# EAGLE design LED Driver (EAGLE 8.6.3)
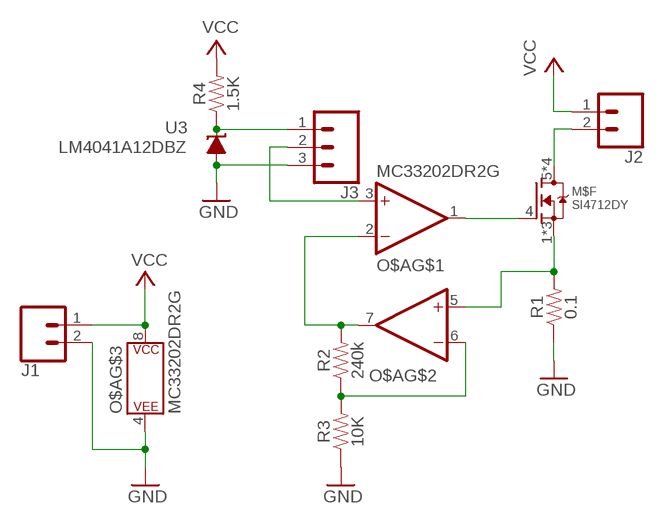
[diagram p0: schematic, sheet 1]

## Parts
J1  CONN_02PTH4  [1X02_XTRA_BIG]
J2  CONN_02PTH4  [1X02_XTRA_BIG]
J3  CONN_03  [1X03]
M$F  SI4712DY  [SO8]
O$A  MC33202DR2G  [SOIC8]
R1  0.1  0.1OHM-1210-1/2W-1%  [1210]
R2  240k  1.20KOHM-0603-1/10W-1%  [0603]
R3  10K  1.20KOHM-0603-1/10W-1%  [0603]
R4  1.5K  1.20KOHM-0603-1/10W-1%  [0603]
U3  LM4041A12DBZ  [DBZ_R-PDSO-G3]

## Nets
GND [POWER]: J1.2 J3.3 O$A.4(P$V-) R1.1 R3.1 U3.2(A)
N$1: J3.1 R4.1 U3.1(C)
N$2: J3.2 O$A.3(+IN)
N$3: M$F.4(G) O$A.1(OUT)
N$4 [POWER]: J2.2 M$F.5(D) M$F.6(D) M$F.7(D) M$F.8(D)
N$5 [POWER]: M$F.1(S) M$F.2(S) M$F.3(S) O$A.5(+IN) R1.2
N$6: O$A.2(-IN) O$A.7(OUT) R2.2
N$7: O$A.6(-IN) R2.1 R3.2
VCC [POWER]: J1.1 J2.1 O$A.8(P$V+) R4.2

## Library data of the parts
J1 J2 = SparkFun-Connectors:CONN_02: Multi connection point. Often used as Generic Header-pin footprint for 0.1 inch spaced/style header connections On any of the 0.1 inch spaced packages, you can populate with these: Break Away Headers - Straight <https://www.sparkfun.com/products/116> (PRT-00116) Break Away Male Headers - Right Angle <https://www.sparkfun.com/products/553> (PRT-00553) Female Headers <https://www.sparkfun.com/products/115> (PRT-00115) Break Away Headers - Machine Pin <https://www.sparkfun.com/products/117> (PRT-00117) Break Away Female Headers - Swiss Machine Pin <https://www.sparkfun.com/products/743> (PRT-00743) For SCREWTERMINALS and SPRING TERMINALS visit here: Screw Terimnals on SparkFun.com <https://www.sparkfun.com/search/results?term=Screw+Terminals> (5mm/3.5mm/2.54mm spacing) This device is also useful as a general connection point to wire up your design to another part of your project. Our various solder wires solder well into these plated through hole pads. Hook-Up Wire - Assortment (Stranded, 22 AWG) <https://www.sparkfun.com/products/11375> (PRT-11375) Hook-Up Wire - Assortment (Solid Core, 22 AWG) <https://www.sparkfun.com/products/11367> (PRT-11367) View the entire wire category on our website here <https://www.sparkfun.com/categories/141> Special notes: Molex polarized connector foot print use with: PRT-08233 with associated crimp pins and housings. 2.54_SCREWTERM for use with PRT-10571. 3.5mm Screw Terminal footprints for PRT-08084 5mm Screw Terminal footprints for use with PRT-08432
J3 = SparkFun-Connectors:CONN_03: Multi connection point. Often used as Generic Header-pin footprint for 0.1 inch spaced/style header connections On any of the 0.1 inch spaced packages, you can populate with these: Break Away Headers - Straight <https://www.sparkfun.com/products/116> (PRT-00116) Break Away Male Headers - Right Angle <https://www.sparkfun.com/products/553> (PRT-00553) Female Headers <https://www.sparkfun.com/products/115> (PRT-00115) Break Away Headers - Machine Pin <https://www.sparkfun.com/products/117> (PRT-00117) Break Away Female Headers - Swiss Machine Pin <https://www.sparkfun.com/products/743> (PRT-00743) Stackable Header - 3 Pin (Female, 0.1") <https://www.sparkfun.com/products/13875> (PRT-13875) For SCREWTERMINALS and SPRING TERMINALS visit here: Screw Terimnals on SparkFun.com <https://www.sparkfun.com/search/results?term=Screw+Terminals> (5mm/3.5mm/2.54mm spacing) This device is also useful as a general connection point to wire up your design to another part of your project. Our various solder wires solder well into these plated through hole pads. Hook-Up Wire - Assortment (Stranded, 22 AWG) <https://www.sparkfun.com/products/11375> (PRT-11375) Hook-Up Wire - Assortment (Solid Core, 22 AWG) <https://www.sparkfun.com/products/11367> (PRT-11367) View the entire wire category on our website here <https://www.sparkfun.com/categories/141> Special notes: Molex polarized connector foot print use with SKU : PRT-08232 with associated crimp pins and housings.
M$F = CECFC:SI4712
O$A = CECFC:MC33202
R1 = SparkFun-Resistors:0.1OHM: 0.1Ω resistor A resistor is a passive two-terminal electrical component that implements electrical resistance as a circuit element. Resistors act to reduce current flow, and, at the same time, act to lower voltage levels within circuits. - Wikipedia; PROD_ID: RES-12374
R2-R4 = SparkFun-Resistors:1.20KOHM: 1.20kΩ resistor A resistor is a passive two-terminal electrical component that implements electrical resistance as a circuit element. Resistors act to reduce current flow, and, at the same time, act to lower voltage levels within circuits. - Wikipedia; PROD_ID: RES-08413; VALUE: 1.20k
U3 = texas:LM4041: PRECISION MICROPOWER SHUNT VOLTAGE REFERENCE Source: http://focus.ti.com/lit/ds/slcs146e/slcs146e.pdf; MPN: LM4041A12IDBZR; OC_FARNELL: 1407949; OC_NEWARK: 58K5875

## Net classes
1 POWER: width 0.889 mm, drill 0.381 mm, clearance 0.203 mm

## Board
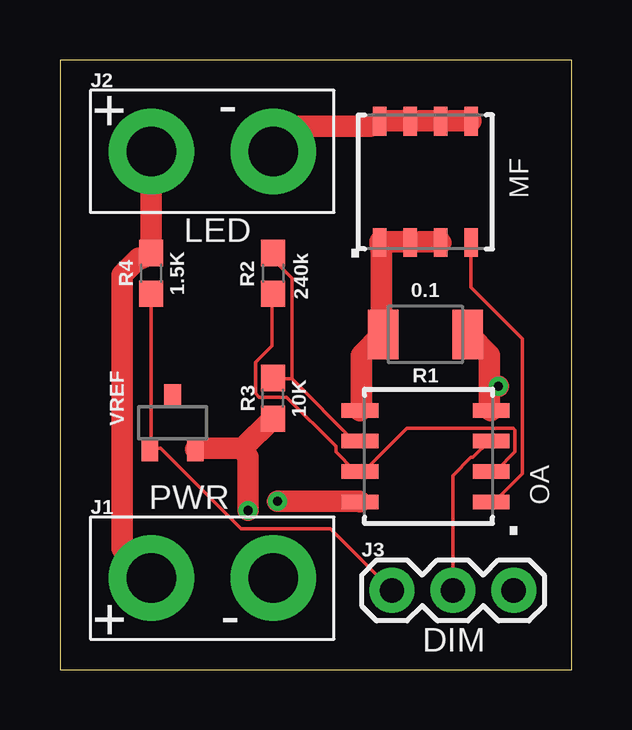
[diagram p1: board, top side]
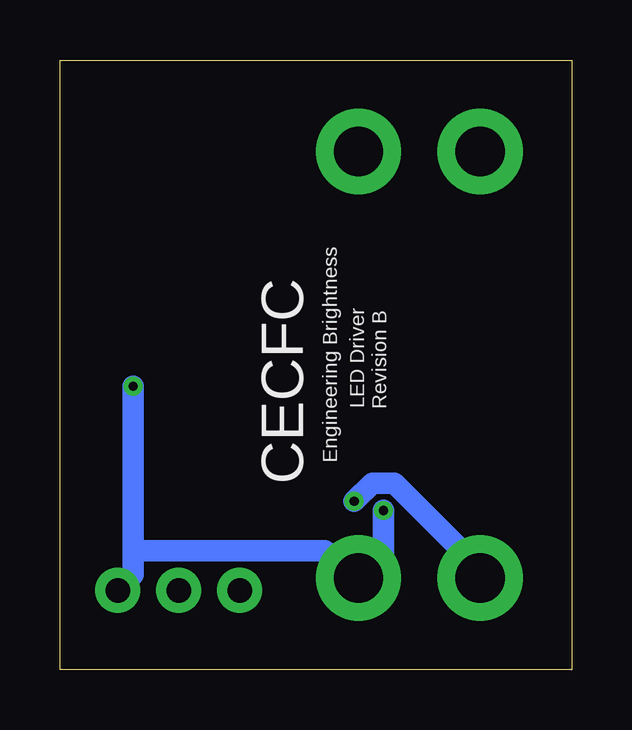
[diagram p2: board, bottom side, seen from below]

Size 21.34 x 25.4 mm. Coordinates in mm from the lower left corner, seen from the top.
Outline: 0,0 21.34,0 21.34,25.4 0,25.4 0,0
Copper layers (1*16): Top 0.035mm / dielectric 1.5mm / Bottom 0.035mm
Design rules "default": minimum track width 6mil, minimum drill 0.35mm, track to track 6mil, track to pad 6mil, pad to pad 6mil, via to via 6mil, smd to smd 6mil, copper to edge 40mil, drill to drill 6mil, minimum pad ring 10mil, minimum via ring 8mil, stop-mask expansion 4mil, vias tented up to drill 0mil, thermal gap 10mil

### Footprints (pad centres in the part's own frame; a part is rotated, then mirrored left to right if it is on the bottom)
1X02_XTRA_BIG = drill 2.057 pad 3.556: 1 -2.54,0; 2 2.54,0
1X03 = drill 1.016 pad 1.88: 1 0,0; 2 2.54,0; 3 5.08,0
SO8 = smd 1.194 x 0.559: 1 -2.527,1.905; 2 -2.527,0.635; 3 -2.527,-0.635; 4 -2.527,-1.905; 5 2.527,-1.905; 6 2.527,-0.635; 7 2.527,0.635; 8 2.527,1.905
SOIC8 = smd 0.61 x 1.524: 1 -1.905,-2.731; 2 -0.635,-2.731; 3 0.635,-2.731; 4 1.905,-2.731; 5 1.905,2.731; 6 0.635,2.731; 7 -0.635,2.731; 8 -1.905,2.731
1210 = smd 1.27 x 2.06: 1 -1.755,0; 2 1.755,0
0603 = smd 1.1 x 1: 1 -0.85,0; 2 0.85,0
DBZ_R-PDSO-G3 = smd 0.7 x 1: 1 -0.95,-1.1; 2 0.95,-1.1; 3 0,1.1

### Placement (x,y rotation side)
J1  6.35,3.81 0 top
J2  6.35,21.59 0 top
J3  13.84,3.3 0 top
M$F  15.24,20.32 90 top
O$A  15.24,8.89 90 top
R1  15.24,13.97 180 top
R2  8.89,16.51 270 top
R3  8.89,11.3 90 top
R4  3.81,16.51 90 top
U3  4.7,10.29 0 top

### Tracks (layer width: path | path; a pad name or v marks a point on that pad's centre or on a via)
GND  (via drill 0.38)
  Top 0.889: 17.91,11.81 17.91,13.11 17.07,13.95 R1.1 | 17.91,11.81 17.91,10.82 O$A.4 | v18.29,11.81 17.91,11.81 | 7.62,9.22 5.71,9.22 U3.2 | 7.62,9.22 8.84,10.44 R3.1 | v7.85,6.63 7.85,8.84 7.62,9.22
  Bottom 0.889: 18.29,4.95 18.29,3.96 18.9,3.35 J3.3 | 18.29,4.95 v18.29,11.81 | v7.85,6.63 7.85,4.8 8.84,3.81 J1.2 9.3,3.96 10.29,4.95 18.29,4.95
N$1
  Top 0.152: R4.1 3.81,9.22 U3.1 3.89,9.22 4.19,9.22 7.54,5.87 11.28,5.87 J3.1
N$2
  Top 0.152: J3.2 16.38,8.08 17.14,8.84 17.22,8.84 17.91,9.53 O$A.3
N$3
  Top 0.152: M$F.4 17.14,15.93 19.28,13.79 19.28,8.15 18.14,7.01 17.98,7.01 O$A.1
N$4
  Top 0.889: M$F.8 14.55,22.86 M$F.7 15.01,22.86 15.85,22.86 M$F.6 16.31,22.86 M$F.5 | M$F.8 | M$F.8 12.95,22.63 9.91,22.63 8.91,21.64 J2.2
N$5
  Top 0.889: M$F.3 15.85,17.83 15.01,17.83 M$F.2 14.55,17.83 13.34,17.83 M$F.1 13.41,17.37 13.41,14.4 R1.2 13.41,13.95 12.57,13.11 12.57,10.82 O$A.5
N$6
  Top 0.152: R2.2 8.84,15.62 8.84,13.49 8.15,12.8 8.15,11.51 8.31,11.35 9.45,11.35 11.51,9.3 11.51,9.07 12.27,8.31 12.5,8.31 O$A.7 12.57,8.31 12.72,8.31 14.48,10.06 18.9,10.06 18.97,9.98 18.97,9.07 18.21,8.31 17.98,8.31 O$A.2
N$7
  Top 0.152: 9.68,12.12 8.91,12.12 R3.2 | 9.68,12.12 12.27,9.53 O$A.6 | 9.68,12.12 9.68,16.31 8.91,17.07 8.91,17.3 R2.1
VCC  (via drill 0.38)
  Top 0.889: J2.1 R4.2 3.43,17.14 3.28,17.14 2.59,16.46 2.59,5.03 J1.1 | v9.07,7.01 12.5,7.01 O$A.8
  Bottom 0.889: v9.07,7.01 8.31,7.77 7.39,7.77 3.81,4.19 J1.1

### Text on the board
tPlace: . | .
bPlace: Engineering Brightness | CECFC | Revision B | LED Driver
tNames: - | + | MF | LED | VREF | OA | PWR | + | - | DIM